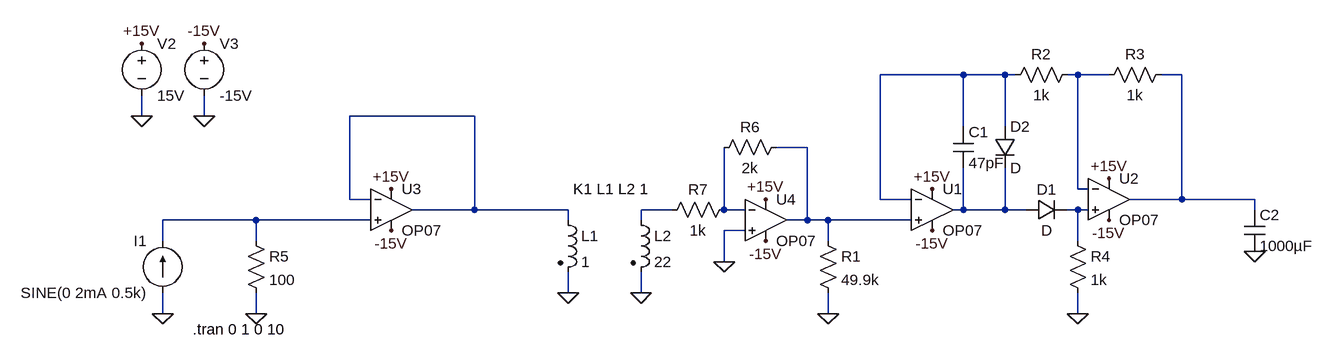
[diagram p0: schematic SP26_MindMasters_FeedbackSimulation_BraxtonLang.asc]
SP26_MindMasters_FeedbackSimulation_BraxtonLang.asc, the LTspice schematic file:
Version 4
SHEET 1 912 680
WIRE 352 -112 224 -112
WIRE 416 -112 352 -112
WIRE 432 -112 416 -112
WIRE 528 -112 512 -112
WIRE 576 -112 528 -112
WIRE 688 -112 656 -112
WIRE -912 -48 -912 -80
WIRE -816 -48 -816 -80
WIRE -400 -48 -592 -48
WIRE 352 -32 352 -112
WIRE 416 -32 416 -112
WIRE 112 0 64 0
WIRE 528 64 528 -112
WIRE 544 64 528 64
WIRE -592 80 -592 -48
WIRE -560 80 -592 80
WIRE 224 80 224 -112
WIRE 272 80 224 80
WIRE 688 80 688 -112
WIRE 688 80 608 80
WIRE 800 80 688 80
WIRE -400 96 -400 -48
WIRE -400 96 -496 96
WIRE -256 96 -400 96
WIRE -96 96 -144 96
WIRE -16 96 -16 0
WIRE 16 96 -16 96
WIRE 352 96 352 32
WIRE 352 96 336 96
WIRE 416 96 416 32
WIRE 416 96 352 96
WIRE 448 96 416 96
WIRE 528 96 512 96
WIRE 544 96 528 96
WIRE 800 96 800 80
WIRE -736 112 -880 112
WIRE -560 112 -736 112
WIRE -256 112 -256 96
WIRE -144 112 -144 96
WIRE 112 112 112 0
WIRE 112 112 80 112
WIRE 144 112 112 112
WIRE 272 112 144 112
WIRE 16 128 -16 128
WIRE -880 144 -880 112
WIRE -736 144 -736 112
WIRE 144 144 144 112
WIRE 528 144 528 96
WIRE -16 176 -16 128
WIRE -256 224 -256 192
WIRE -144 224 -144 192
WIRE -880 256 -880 224
WIRE -736 256 -736 224
WIRE 144 256 144 224
WIRE 528 256 528 224
FLAG 144 256 0
FLAG -736 256 0
FLAG 528 256 0
FLAG -912 -48 0
FLAG -816 -48 0
FLAG -912 -160 +15V
FLAG 304 64 +15V
FLAG 576 48 +15V
FLAG -816 -160 -15V
FLAG 304 128 -15V
FLAG 576 112 -15V
FLAG -880 256 0
FLAG -528 128 -15V
FLAG -528 64 +15V
FLAG -144 224 0
FLAG -256 224 0
FLAG -16 176 0
FLAG 48 144 -15V
FLAG 48 80 +15V
FLAG 800 160 0
SYMBOL res 128 128 R0
SYMATTR InstName R1
SYMATTR Value 49.9k
SYMBOL OpAmps\\OP07 304 32 R0
SYMATTR InstName U1
SYMBOL OpAmps\\OP07 576 16 R0
SYMATTR InstName U2
SYMBOL diode 448 112 R270
WINDOW 0 32 32 VTop 2
WINDOW 3 0 32 VBottom 2
SYMATTR InstName D1
SYMBOL diode 400 -32 R0
SYMATTR InstName D2
SYMBOL cap 336 -32 R0
SYMATTR InstName C1
SYMATTR Value 47pF
SYMBOL res 528 -128 R90
WINDOW 0 0 56 VBottom 2
WINDOW 3 32 56 VTop 2
SYMATTR InstName R2
SYMATTR Value 1k
SYMBOL res 672 -128 R90
WINDOW 0 0 56 VBottom 2
WINDOW 3 32 56 VTop 2
SYMATTR InstName R3
SYMATTR Value 1k
SYMBOL res 512 128 R0
SYMATTR InstName R4
SYMATTR Value 1k
SYMBOL voltage -912 -176 R0
WINDOW 123 0 0 Left 0
WINDOW 39 0 0 Left 0
SYMATTR InstName V2
SYMATTR Value 15V
SYMBOL voltage -816 -176 R0
WINDOW 123 0 0 Left 0
WINDOW 39 0 0 Left 0
SYMATTR InstName V3
SYMATTR Value -15V
SYMBOL res -752 128 R0
SYMATTR InstName R5
SYMATTR Value 100
SYMBOL current -880 224 R180
WINDOW 0 24 80 Left 2
WINDOW 3 24 0 Left 2
WINDOW 123 0 0 Left 0
WINDOW 39 0 0 Left 0
SYMATTR InstName I1
SYMATTR Value SINE(0 2mA 0.5k)
SYMBOL OpAmps\\OP07 -528 32 R0
SYMATTR InstName U3
SYMBOL ind2 -272 96 R0
SYMATTR InstName L1
SYMATTR Value 1
SYMATTR Type ind
SYMBOL ind2 -160 96 R0
SYMATTR InstName L2
SYMATTR Value 22
SYMATTR Type ind
SYMBOL OpAmps\\OP07 48 48 R0
SYMATTR InstName U4
SYMBOL res 80 -16 R90
WINDOW 0 0 56 VBottom 2
WINDOW 3 32 56 VTop 2
SYMATTR InstName R6
SYMATTR Value 2k
SYMBOL res 0 80 R90
WINDOW 0 0 56 VBottom 2
WINDOW 3 32 56 VTop 2
SYMATTR InstName R7
SYMATTR Value 1k
SYMBOL cap 784 96 R0
SYMATTR InstName C2
SYMATTR Value 1000µF
TEXT -834 280 Left 2 !.tran 0 1 0 10
TEXT -248 64 Left 2 !K1 L1 L2 1

The netlist it stands for:
* SP26_MindMasters_FeedbackSimulation_BraxtonLang.asc
R1 N005 0 49.9k
XU1 N005 N001 +15V -15V N008 LT1001  ; OP07, pins In+ In- V+ V- OUT
XU2 N009 N002 +15V -15V N003 LT1001  ; OP07, pins In+ In- V+ V- OUT
D1 N008 N009 D
D2 N001 N008 D
C1 N001 N008 47pF
R2 N002 N001 1k
R3 N003 N002 1k
R4 N009 0 1k
V2 +15V 0 15V
V3 -15V 0 -15V
R5 N010 0 100
I1 0 N010 SINE(0 2mA 0.5k)
XU3 N010 N004 +15V -15V N004 LT1001  ; OP07, pins In+ In- V+ V- OUT
L1 N004 0 1
L2 N006 0 22
XU4 0 N007 +15V -15V N005 LT1001  ; OP07, pins In+ In- V+ V- OUT
R6 N005 N007 2k
R7 N007 N006 1k
C2 N003 0 1000µF
.model D D
.lib standard.dio
.tran 0 1 0 10
K1 L1 L2 1
.lib LTC.lib
.backanno
.end